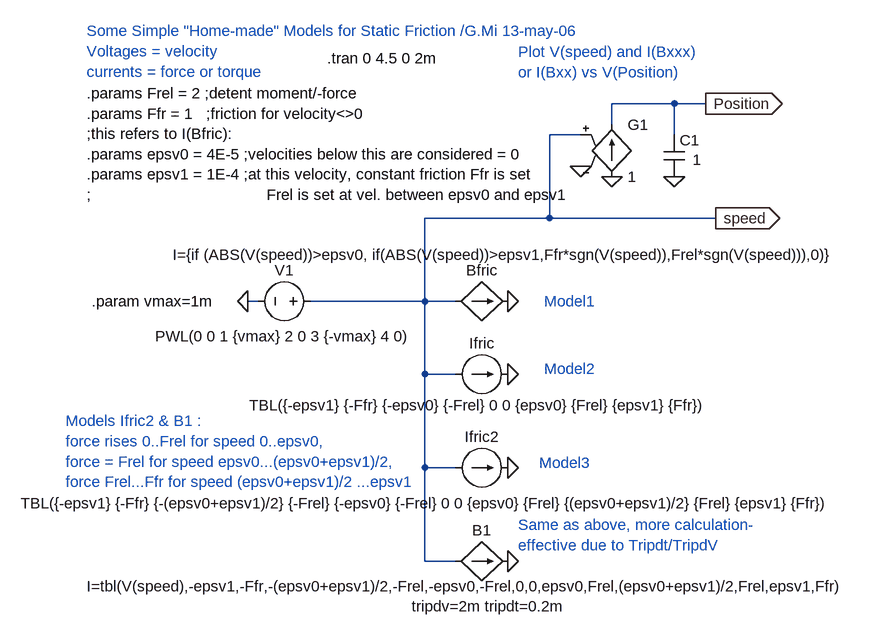
[diagram p0: schematic friction_models_simple.asc]
friction_models_simple.asc, the LTspice schematic file:
Version 4
SHEET 1 1276 924
WIRE -288 240 -304 240
WIRE -32 240 -208 240
WIRE -32 240 -32 112
WIRE -32 352 -32 240
WIRE -32 496 -32 352
WIRE -32 640 -32 496
WIRE 16 240 -32 240
WIRE 16 352 -32 352
WIRE 16 496 -32 496
WIRE 16 640 -32 640
WIRE 160 112 -32 112
WIRE 160 112 160 -16
WIRE 208 -16 160 -16
WIRE 256 -32 256 -64
WIRE 352 -64 256 -64
WIRE 352 -16 352 -64
WIRE 400 -64 352 -64
WIRE 416 112 160 112
FLAG -304 240 0
FLAG 96 240 0
FLAG 416 112 speed
IOPIN 416 112 Out
FLAG 96 352 0
FLAG 96 496 0
FLAG 96 640 0
FLAG 256 48 0
FLAG 208 32 0
FLAG 400 -64 Position
IOPIN 400 -64 Out
FLAG 352 48 0
SYMBOL bi 16 240 R270
WINDOW 0 32 40 VTop 0
WINDOW 3 87 78 VBottom 0
SYMATTR InstName Bfric
SYMATTR Value I={if (ABS(V(speed))>epsv0, if(ABS(V(speed))>epsv1,Ffr*sgn(V(speed)),Frel*sgn(V(speed))),0)}
SYMBOL voltage -192 240 M270
WINDOW 0 32 56 VTop 0
WINDOW 3 -54 -139 VRight 0
WINDOW 123 0 0 Left 0
WINDOW 39 -82 -139 VRight 0
SYMATTR InstName V1
SYMATTR Value PWL(0 0 1 {vmax} 2 0 3 {-vmax} 4 0)
SYMBOL current 16 352 R270
WINDOW 0 32 40 VTop 0
WINDOW 3 -32 40 VBottom 0
WINDOW 123 -32 40 VBottom 0
WINDOW 39 -32 40 VBottom 0
SYMATTR InstName Ifric
SYMATTR Value TBL({-epsv1} {-Ffr} {-epsv0} {-Frel} 0 0 {epsv0} {Frel} {epsv1} {Ffr})
SYMBOL current 16 496 R270
WINDOW 3 -39 -35 VBottom 0
WINDOW 0 32 40 VTop 0
WINDOW 123 0 0 Left 0
WINDOW 39 0 0 Left 0
SYMATTR Value TBL({-epsv1} {-Ffr} {-(epsv0+epsv1)/2} {-Frel} {-epsv0} {-Frel} 0 0 {epsv0} {Frel} {(epsv0+epsv1)/2} {Frel} {epsv1} {Ffr})
SYMATTR InstName Ifric2
SYMBOL bi 16 640 R270
WINDOW 0 32 40 VTop 0
WINDOW 3 -54 21 VTop 0
WINDOW 123 -85 50 VTop 0
SYMATTR InstName B1
SYMATTR Value I=tbl(V(speed),-epsv1,-Ffr,-(epsv0+epsv1)/2,-Frel,-epsv0,-Frel,0,0,epsv0,Frel,(epsv0+epsv1)/2,Frel,epsv1,Ffr)
SYMATTR Value2 tripdv=2m tripdt=0.2m
SYMBOL g 256 -48 R0
SYMATTR InstName G1
SYMATTR Value 1
SYMBOL cap 336 -16 R0
WINDOW 3 44 38 Left 0
SYMATTR Value 1
SYMATTR InstName C1
TEXT -182 -134 Left 0 !.tran 0 4.5 0 2m
TEXT -552 -176 Left 0 ;Some Simple "Home-made" Models for Static Friction /G.Mi 13-may-06\nVoltages = velocity\ncurrents = force or torque
TEXT -552 -80 Left 0 !.params Frel = 2 ;detent moment/-force\n.params Ffr = 1   ;friction for velocity<>0\n;this refers to I(Bfric):\n.params epsv0 = 4E-5 ;velocities below this are considered = 0\n.params epsv1 = 1E-4 ;at this velocity, constant friction Ffr is set\n;                                       Frel is set at vel. between epsv0 and epsv1
TEXT 112 584 Left 0 ;Same as above, more calculation-\neffective due to Tripdt/TripdV
TEXT -584 424 Left 0 ;Models Ifric2 & B1 :\nforce rises 0..Frel for speed 0..epsv0,\nforce = Frel for speed epsv0...(epsv0+epsv1)/2,\nforce Frel...Ffr for speed (epsv0+epsv1)/2 ...epsv1
TEXT 152 240 Left 0 ;Model1
TEXT 152 344 Left 0 ;Model2
TEXT 144 488 Left 0 ;Model3
TEXT -544 240 Left 0 !.param vmax=1m
TEXT 112 -144 Left 0 ;Plot V(speed) and I(Bxxx)\nor I(Bxx) vs V(Position)

The netlist it stands for:
* friction_models_simple.asc
Bfric speed 0 I={if (ABS(V(speed))>epsv0, if(ABS(V(speed))>epsv1,Ffr*sgn(V(speed)),Frel*sgn(V(speed))),0)}
V1 speed 0 PWL(0 0 1 {vmax} 2 0 3 {-vmax} 4 0)
Ifric speed 0 TBL({-epsv1} {-Ffr} {-epsv0} {-Frel} 0 0 {epsv0} {Frel} {epsv1} {Ffr})
Ifric2 speed 0 TBL({-epsv1} {-Ffr} {-(epsv0+epsv1)/2} {-Frel} {-epsv0} {-Frel} 0 0 {epsv0} {Frel} {(epsv0+epsv1)/2} {Frel} {epsv1} {Ffr})
B1 speed 0 I=tbl(V(speed),-epsv1,-Ffr,-(epsv0+epsv1)/2,-Frel,-epsv0,-Frel,0,0,epsv0,Frel,(epsv0+epsv1)/2,Frel,epsv1,Ffr) tripdv=2m tripdt=0.2m
G1 0 Position speed 0 1
C1 Position 0 1
.tran 0 4.5 0 2m
* Some Simple "Home-made" Models for Static Friction /G.Mi 13-may-06
* Voltages = velocity
* currents = force or torque
.params Frel = 2 ;detent moment/-force
.params Ffr = 1   ;friction for velocity<>0
;this refers to I(Bfric):
.params epsv0 = 4E-5 ;velocities below this are considered = 0
.params epsv1 = 1E-4 ;at this velocity, constant friction Ffr is set
;                                       Frel is set at vel. between epsv0 and epsv1
* Same as above, more calculation-
* effective due to Tripdt/TripdV
* Models Ifric2 & B1 :
* force rises 0..Frel for speed 0..epsv0,
* force = Frel for speed epsv0...(epsv0+epsv1)/2,
* force Frel...Ffr for speed (epsv0+epsv1)/2 ...epsv1
* Model1
* Model2
* Model3
.param vmax=1m
* Plot V(speed) and I(Bxxx)
* or I(Bxx) vs V(Position)
.backanno
.end